# Altium schematic sheet Memory Chips 1 to 4.SchDoc
size A3
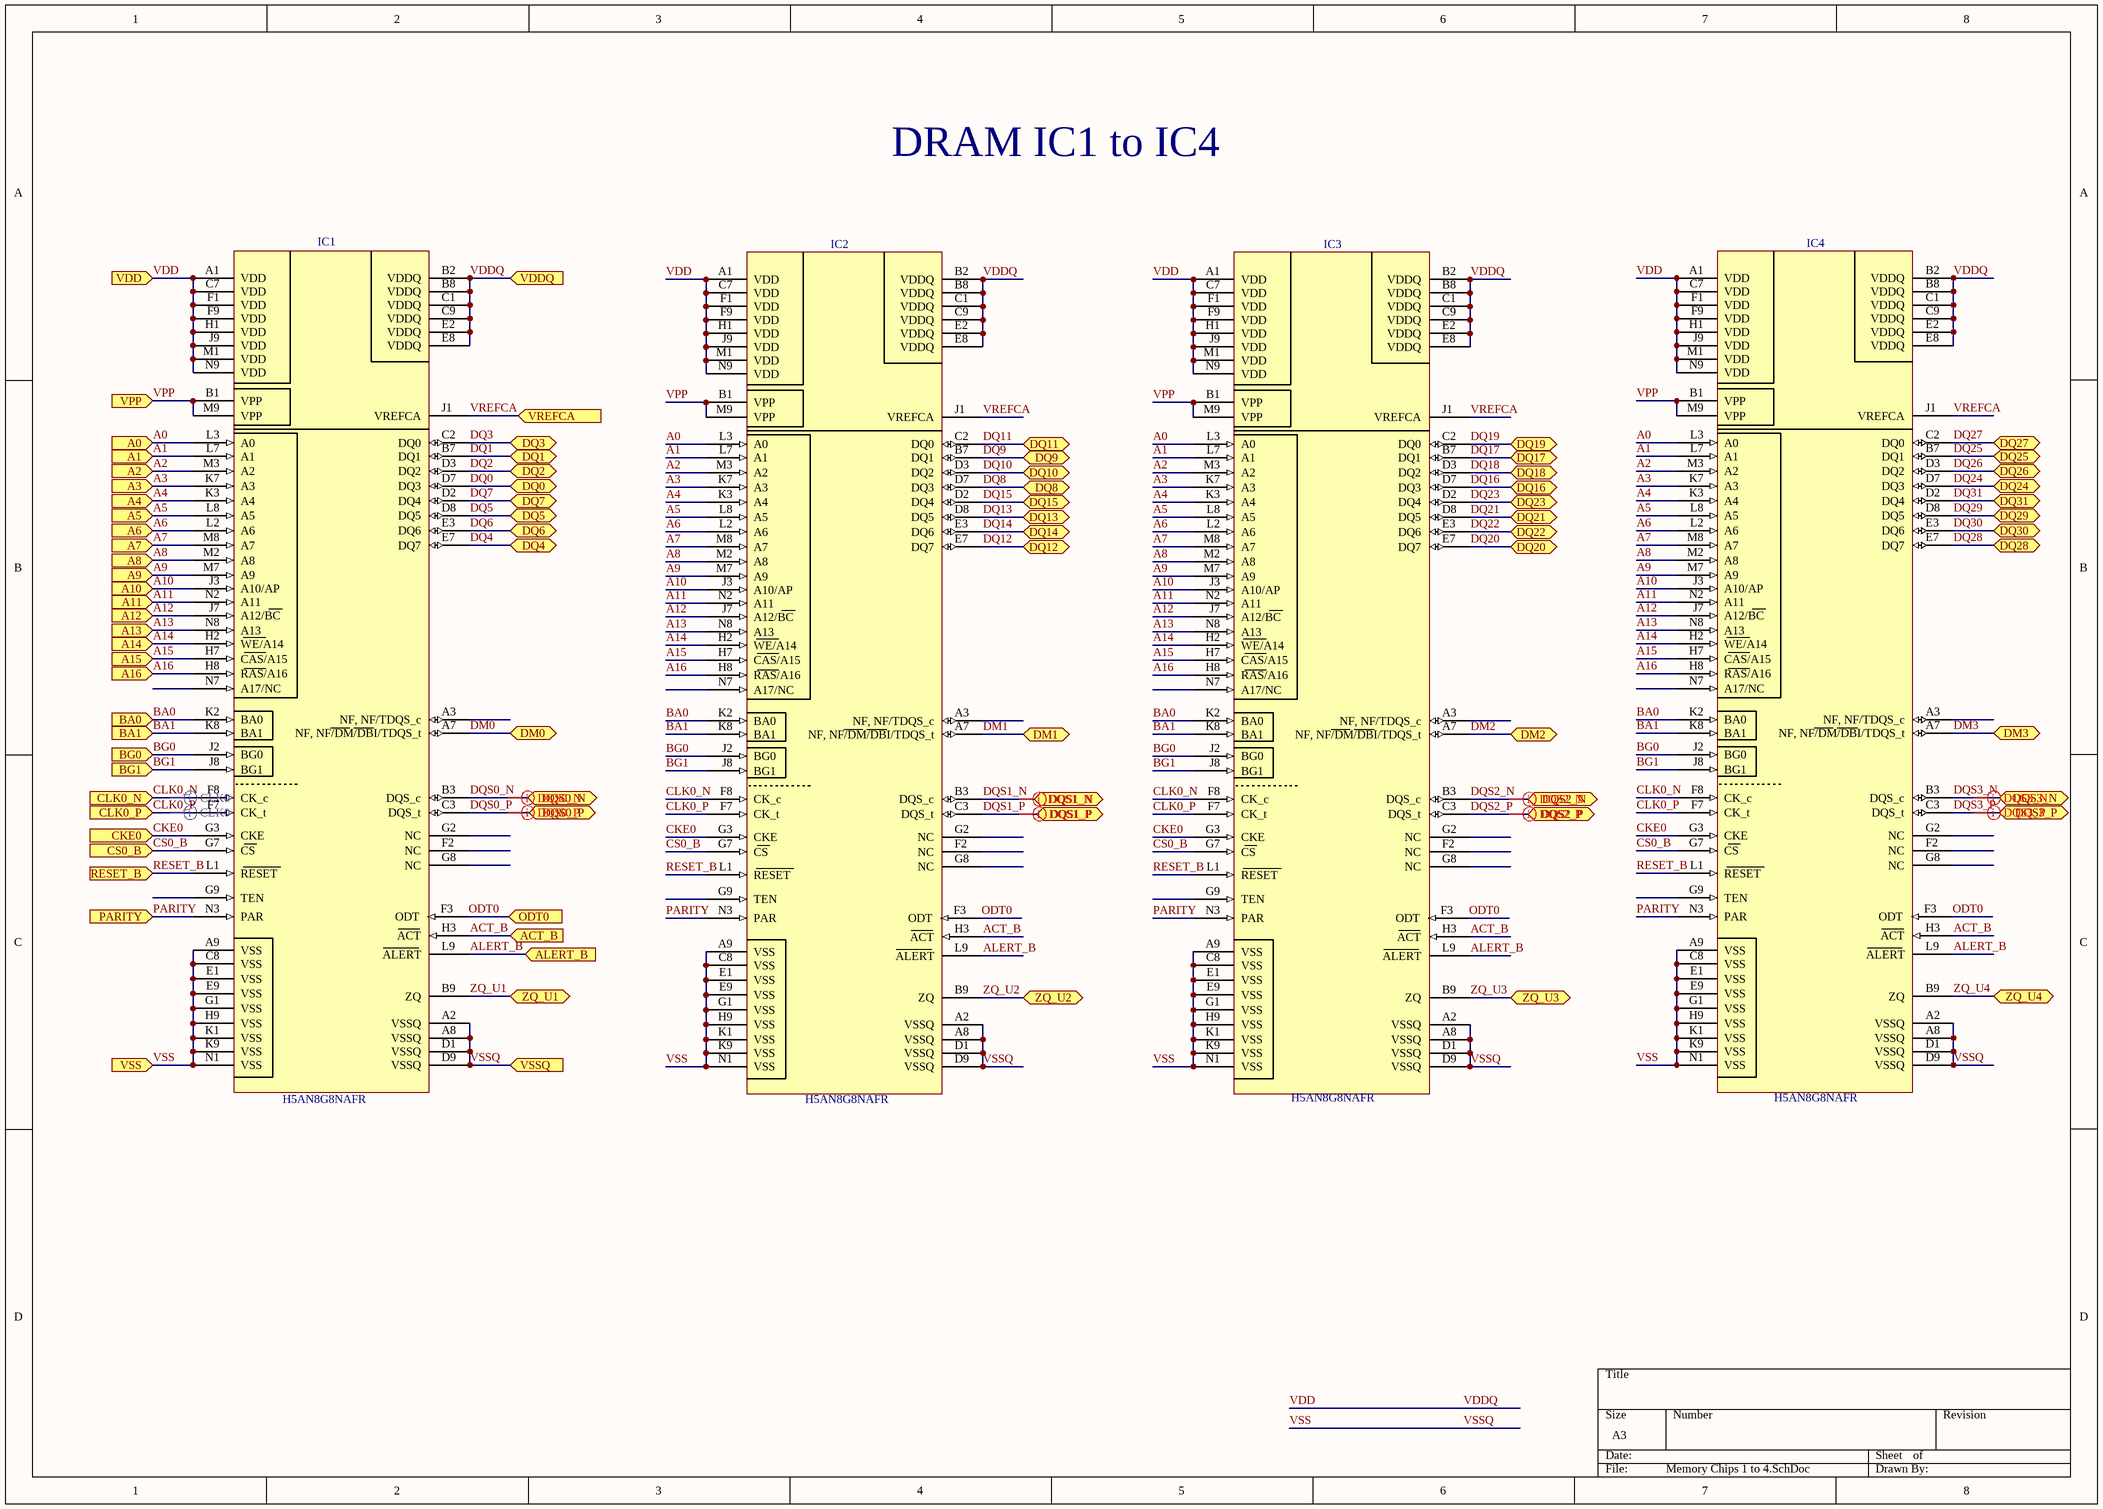
[diagram p0: Memory Chips 1 to 4.SchDoc]

## Parts
IC1  H5AN8G8NAFR  [H5AN8G8NAFR]
IC2  H5AN8G8NAFR  [H5AN8G8NAFR]
IC3  H5AN8G8NAFR  [H5AN8G8NAFR]
IC4  H5AN8G8NAFR  [H5AN8G8NAFR]

## Ports
A0 (in), A1 (in), A2 (in), A3 (in), A4 (in), A5 (in), A6 (in), A7 (in), A8 (in), A9 (in), A10 (in), A11 (in), A12 (in), A13 (in), A14 (in), A15 (in), A16 (in), ACT_B (in), ALERT_B (in), BA0 (in), BA1 (in), BG0 (in), BG1 (in), CKE0 (in), CLK0_N (in), CLK0_P (in), CS0_B (in), DM0 (bidir), DM1 (bidir), DM2 (bidir), DM3 (bidir), DQ0 (bidir), DQ1 (bidir), DQ2 (bidir), DQ3 (bidir), DQ4 (bidir), DQ5 (bidir), DQ6 (bidir), DQ7 (bidir), DQ8 (bidir), DQ9 (bidir), DQ10 (bidir), DQ11 (bidir), DQ12 (bidir), DQ13 (bidir), DQ14 (bidir), DQ15 (bidir), DQ16 (bidir), DQ17 (bidir), DQ18 (bidir), DQ19 (bidir), DQ20 (bidir), DQ21 (bidir), DQ22 (bidir), DQ23 (bidir), DQ24 (bidir), DQ25 (bidir), DQ26 (bidir), DQ27 (bidir), DQ28 (bidir), DQ29 (bidir), DQ30 (bidir), DQ31 (bidir), DQS0_N (bidir), DQS0_P (bidir), DQS1_N (bidir), DQS1_P (bidir), DQS2_N (bidir), DQS2_P (bidir), DQS3_N (bidir), DQS3_P (bidir), ODT0 (in), PARITY (in), RESET_B (in), VDD (in), VDDQ (in), VPP (in), VREFCA (in), VSS (in), VSSQ (in), ZQ_U1 (bidir), ZQ_U2 (bidir), ZQ_U3 (bidir), ZQ_U4 (bidir)

## Nets
A0: IC1.L3(A0) IC2.L3(A0) IC3.L3(A0) IC4.L3(A0) ; port A0
A1: IC1.L7(A1) IC2.L7(A1) IC3.L7(A1) IC4.L7(A1) ; port A1
A2: IC1.M3(A2) IC2.M3(A2) IC3.M3(A2) IC4.M3(A2) ; port A2
A3: IC1.K7(A3) IC2.K7(A3) IC3.K7(A3) IC4.K7(A3) ; port A3
A4: IC1.K3(A4) IC2.K3(A4) IC3.K3(A4) IC4.K3(A4) ; port A4
A5: IC1.L8(A5) IC2.L8(A5) IC3.L8(A5) IC4.L8(A5) ; port A5
A6: IC1.L2(A6) IC2.L2(A6) IC3.L2(A6) IC4.L2(A6) ; port A6
A7: IC1.M8(A7) IC2.M8(A7) IC3.M8(A7) IC4.M8(A7) ; port A7
A8: IC1.M2(A8) IC2.M2(A8) IC3.M2(A8) IC4.M2(A8) ; port A8
A9: IC1.M7(A9) IC2.M7(A9) IC3.M7(A9) IC4.M7(A9) ; port A9
A10: IC1.J3(A10/AP) IC2.J3(A10/AP) IC3.J3(A10/AP) IC4.J3(A10/AP) ; port A10
A11: IC1.N2(A11) IC2.N2(A11) IC3.N2(A11) IC4.N2(A11) ; port A11
A12: IC1.J7(A12/BC) IC2.J7(A12/BC) IC3.J7(A12/BC) IC4.J7(A12/BC) ; port A12
A13: IC1.N8(A13) IC2.N8(A13) IC3.N8(A13) IC4.N8(A13) ; port A13
A14: IC1.H2(WE/A14) IC2.H2(WE/A14) IC3.H2(WE/A14) IC4.H2(WE/A14) ; port A14
A15: IC1.H7(CAS/A15) IC2.H7(CAS/A15) IC3.H7(CAS/A15) IC4.H7(CAS/A15) ; port A15
A16: IC1.H8(RAS/A16) IC2.H8(RAS/A16) IC3.H8(RAS/A16) IC4.H8(RAS/A16) ; port A16
ACT_B: IC1.H3(ACT) IC2.H3(ACT) IC3.H3(ACT) IC4.H3(ACT) ; port ACT_B
ALERT_B: IC1.L9(ALERT) IC2.L9(ALERT) IC3.L9(ALERT) IC4.L9(ALERT) ; port ALERT_B
BA0: IC1.K2(BA0) IC2.K2(BA0) IC3.K2(BA0) IC4.K2(BA0) ; port BA0
BA1: IC1.K8(BA1) IC2.K8(BA1) IC3.K8(BA1) IC4.K8(BA1) ; port BA1
BG0: IC1.J2(BG0) IC2.J2(BG0) IC3.J2(BG0) IC4.J2(BG0) ; port BG0
BG1: IC1.J8(BG1) IC2.J8(BG1) IC3.J8(BG1) IC4.J8(BG1) ; port BG1
CKE0: IC1.G3(CKE) IC2.G3(CKE) IC3.G3(CKE) IC4.G3(CKE) ; port CKE0
CLK0_N: IC1.F8(CK_c) IC2.F8(CK_c) IC3.F8(CK_c) IC4.F8(CK_c) ; port CLK0_N
CLK0_P: IC1.F7(CK_t) IC2.F7(CK_t) IC3.F7(CK_t) IC4.F7(CK_t) ; port CLK0_P
CS0_B: IC1.G7(CS) IC2.G7(CS) IC3.G7(CS) IC4.G7(CS) ; port CS0_B
DM0: IC1.A7(NF,_NF/DM/DBI/TDQS_t) ; port DM0
DM1: IC2.A7(NF,_NF/DM/DBI/TDQS_t) ; port DM1
DM2: IC3.A7(NF,_NF/DM/DBI/TDQS_t) ; port DM2
DM3: IC4.A7(NF,_NF/DM/DBI/TDQS_t) ; port DM3
DQ0: IC1.D7(DQ3) ; port DQ0
DQ1: IC1.B7(DQ1) ; port DQ1
DQ2: IC1.D3(DQ2) ; port DQ2
DQ3: IC1.C2(DQ0) ; port DQ3
DQ4: IC1.E7(DQ7) ; port DQ4
DQ5: IC1.D8(DQ5) ; port DQ5
DQ6: IC1.E3(DQ6) ; port DQ6
DQ7: IC1.D2(DQ4) ; port DQ7
DQ8: IC2.D7(DQ3) ; port DQ8
DQ9: IC2.B7(DQ1) ; port DQ9
DQ10: IC2.D3(DQ2) ; port DQ10
DQ11: IC2.C2(DQ0) ; port DQ11
DQ12: IC2.E7(DQ7) ; port DQ12
DQ13: IC2.D8(DQ5) ; port DQ13
DQ14: IC2.E3(DQ6) ; port DQ14
DQ15: IC2.D2(DQ4) ; port DQ15
DQ16: IC3.D7(DQ3) ; port DQ16
DQ17: IC3.B7(DQ1) ; port DQ17
DQ18: IC3.D3(DQ2) ; port DQ18
DQ19: IC3.C2(DQ0) ; port DQ19
DQ20: IC3.E7(DQ7) ; port DQ20
DQ21: IC3.D8(DQ5) ; port DQ21
DQ22: IC3.E3(DQ6) ; port DQ22
DQ23: IC3.D2(DQ4) ; port DQ23
DQ24: IC4.D7(DQ3) ; port DQ24
DQ25: IC4.B7(DQ1) ; port DQ25
DQ26: IC4.D3(DQ2) ; port DQ26
DQ27: IC4.C2(DQ0) ; port DQ27
DQ28: IC4.E7(DQ7) ; port DQ28
DQ29: IC4.D8(DQ5) ; port DQ29
DQ30: IC4.E3(DQ6) ; port DQ30
DQ31: IC4.D2(DQ4) ; port DQ31
DQS0_N: IC1.B3(DQS_c) ; port DQS0_N
DQS0_P: IC1.C3(DQS_t) ; port DQS0_P
DQS1_N: IC2.B3(DQS_c) ; port DQS1_N
DQS1_P: IC2.C3(DQS_t) ; port DQS1_P
DQS2_N: IC3.B3(DQS_c) ; port DQS2_N
DQS2_P: IC3.C3(DQS_t) ; port DQS2_P
DQS3_N: IC4.B3(DQS_c) ; port DQS3_N
DQS3_P: IC4.C3(DQS_t) ; port DQS3_P
ODT0: IC1.F3(ODT) IC2.F3(ODT) IC3.F3(ODT) IC4.F3(ODT) ; port ODT0
PARITY: IC1.N3(PAR) IC2.N3(PAR) IC3.N3(PAR) IC4.N3(PAR) ; port PARITY
RESET_B: IC1.L1(RESET) IC2.L1(RESET) IC3.L1(RESET) IC4.L1(RESET) ; port RESET_B
VDD: IC1.A1(VDD) IC1.B2(VDDQ) IC1.B8(VDDQ) IC1.C1(VDDQ) IC1.C7(VDD) IC1.C9(VDDQ) IC1.E2(VDDQ) IC1.E8(VDDQ) IC1.F1(VDD) IC1.F9(VDD) IC1.H1(VDD) IC1.J9(VDD) IC1.M1(VDD) IC1.N9(VDD) IC2.A1(VDD) IC2.B2(VDDQ) IC2.B8(VDDQ) IC2.C1(VDDQ) IC2.C7(VDD) IC2.C9(VDDQ) IC2.E2(VDDQ) IC2.E8(VDDQ) IC2.F1(VDD) IC2.F9(VDD) IC2.H1(VDD) IC2.J9(VDD) IC2.M1(VDD) IC2.N9(VDD) IC3.A1(VDD) IC3.B2(VDDQ) IC3.B8(VDDQ) IC3.C1(VDDQ) IC3.C7(VDD) IC3.C9(VDDQ) IC3.E2(VDDQ) IC3.E8(VDDQ) IC3.F1(VDD) IC3.F9(VDD) IC3.H1(VDD) IC3.J9(VDD) IC3.M1(VDD) IC3.N9(VDD) IC4.A1(VDD) IC4.B2(VDDQ) IC4.B8(VDDQ) IC4.C1(VDDQ) IC4.C7(VDD) IC4.C9(VDDQ) IC4.E2(VDDQ) IC4.E8(VDDQ) IC4.F1(VDD) IC4.F9(VDD) IC4.H1(VDD) IC4.J9(VDD) IC4.M1(VDD) IC4.N9(VDD) ; port VDD, port VDDQ  [also labelled VDDQ]
VPP: IC1.B1(VPP) IC1.M9(VPP) IC2.B1(VPP) IC2.M9(VPP) IC3.B1(VPP) IC3.M9(VPP) IC4.B1(VPP) IC4.M9(VPP) ; port VPP
VREFCA: IC1.J1(VREFCA) IC2.J1(VREFCA) IC3.J1(VREFCA) IC4.J1(VREFCA) ; port VREFCA
VSS: IC1.A2(VSSQ) IC1.A8(VSSQ) IC1.A9(VSS) IC1.C8(VSS) IC1.D1(VSSQ) IC1.D9(VSSQ) IC1.E1(VSS) IC1.E9(VSS) IC1.G1(VSS) IC1.H9(VSS) IC1.K1(VSS) IC1.K9(VSS) IC1.N1(VSS) IC2.A2(VSSQ) IC2.A8(VSSQ) IC2.A9(VSS) IC2.C8(VSS) IC2.D1(VSSQ) IC2.D9(VSSQ) IC2.E1(VSS) IC2.E9(VSS) IC2.G1(VSS) IC2.H9(VSS) IC2.K1(VSS) IC2.K9(VSS) IC2.N1(VSS) IC3.A2(VSSQ) IC3.A8(VSSQ) IC3.A9(VSS) IC3.C8(VSS) IC3.D1(VSSQ) IC3.D9(VSSQ) IC3.E1(VSS) IC3.E9(VSS) IC3.G1(VSS) IC3.H9(VSS) IC3.K1(VSS) IC3.K9(VSS) IC3.N1(VSS) IC4.A2(VSSQ) IC4.A8(VSSQ) IC4.A9(VSS) IC4.C8(VSS) IC4.D1(VSSQ) IC4.D9(VSSQ) IC4.E1(VSS) IC4.E9(VSS) IC4.G1(VSS) IC4.H9(VSS) IC4.K1(VSS) IC4.K9(VSS) IC4.N1(VSS) ; port VSS, port VSSQ  [also labelled VSSQ]
ZQ_U1: IC1.B9(ZQ) ; port ZQ_U1
ZQ_U2: IC2.B9(ZQ) ; port ZQ_U2
ZQ_U3: IC3.B9(ZQ) ; port ZQ_U3
ZQ_U4: IC4.B9(ZQ) ; port ZQ_U4

Not connected (* = marked no-connect by the designer): IC1 A3(NF,_NF/TDQS_c) F2(NC) G2(NC) G8(NC) G9(TEN) N7(A17/NC); IC2 A3(NF,_NF/TDQS_c) F2(NC) G2(NC) G8(NC) G9(TEN) N7(A17/NC); IC3 A3(NF,_NF/TDQS_c) F2(NC) G2(NC) G8(NC) G9(TEN) N7(A17/NC); IC4 A3(NF,_NF/TDQS_c) F2(NC) G2(NC) G8(NC) G9(TEN) N7(A17/NC)

## Layout directives
differential pair: CLK0_N, CLK0_P, DQS0_N, DQS0_P, DQS1_N, DQS1_P, DQS2_N, DQS2_P, DQS3_N, DQS3_P

## Notes on the sheet
- DRAM IC1 to IC4